# Altium schematic sheet PDMTest.SchDoc
size A4
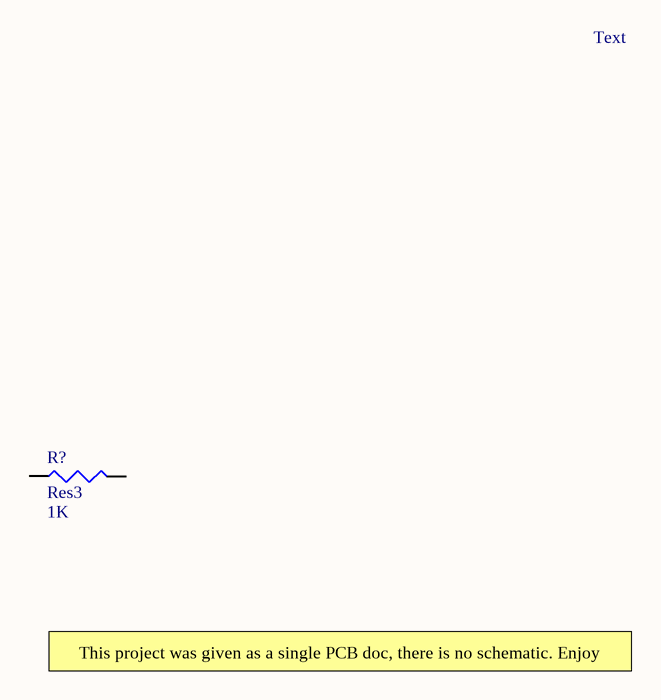
[diagram p0: PDMTest.SchDoc]

## Parts
R?  Res3  value 1K  [12Z-2010]

## Nets

Not connected (* = marked no-connect by the designer): R? 1 2

## Notes on the sheet
- Text
- This project was given as a single PCB doc, there is no schematic. Enjoy

## Library data of the parts
R? = Res3: Resistor; Published: 8-Jun-2000; LatestRevisionDate: 29-May-2009; LatestRevisionNote: IPC-7351 Footprint Added.; PackageReference: J1-0603; Publisher: Altium Limited; PackageDescription: Chip Resistor